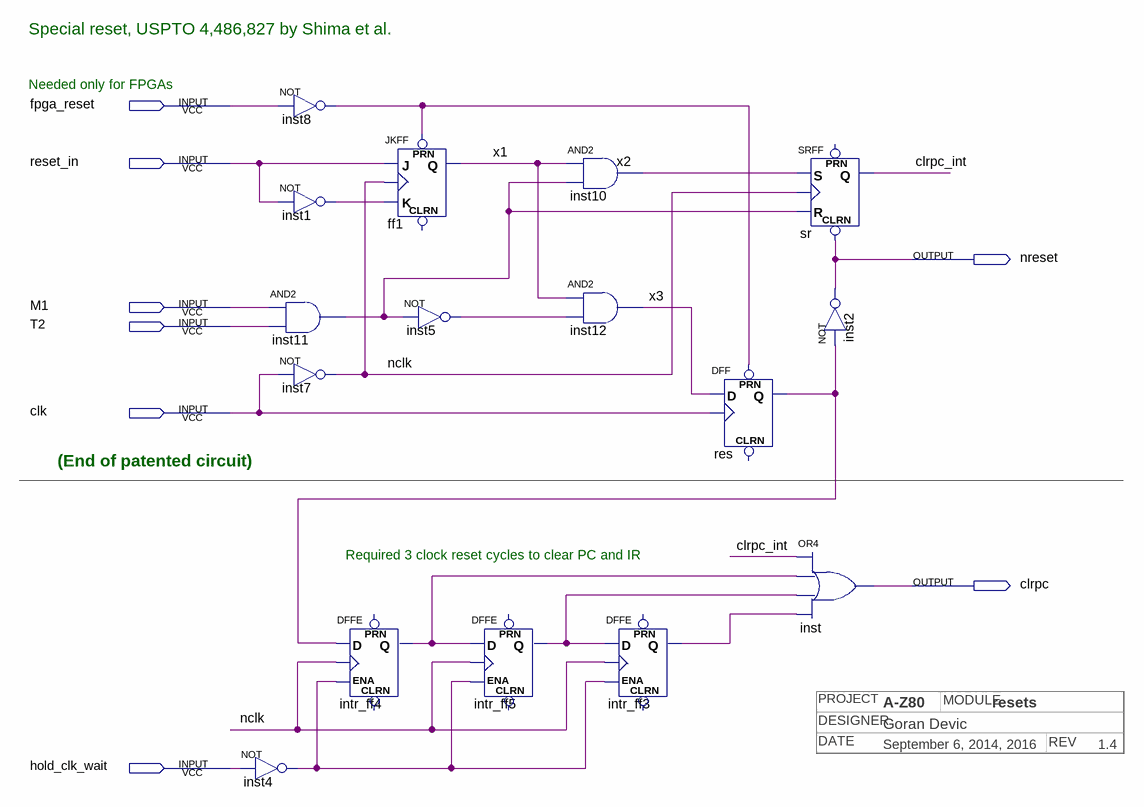
[diagram p0: schematic sheet]
// Quartus schematic resets.bdf as structural Verilog: 16 symbols, 8 pins
// Title block: DATE: September 6, 2014, 2016; DESIGNER: Goran Devic; MODULE: resets; PROJECT: A-Z80; REV: 1.4
module resets (
  input  fpga_reset,
  input  reset_in,
  input  M1,
  input  T2,
  input  clk,
  input  hold_clk_wait,
  output nreset,
  output clrpc
);

  wire clrpc_int, inst1_out, inst4_out, inst5_out, inst8_out, inst11_out, intr_ff3_q, intr_ff4_q, intr_ff5_q,
       nclk, res_q, x1, x2, x3;

  not inst8 (inst8_out, fpga_reset);
  not inst1 (inst1_out, reset_in);
  and inst11 (inst11_out, M1, T2);
  not inst7 (nclk, clk);
  not inst4 (inst4_out, hold_clk_wait);
  DFFE intr_ff4 (.D(res_q), .CLK(nclk), .ENA(inst4_out), .Q(intr_ff4_q));  // open: PRN, CLRN
  JKFF ff1 (.PRN(inst8_out), .K(inst1_out), .J(reset_in), .CLK(nclk), .Q(x1));  // open: CLRN
  not inst5 (inst5_out, inst11_out);
  DFFE intr_ff5 (.D(intr_ff4_q), .CLK(nclk), .ENA(inst4_out), .Q(intr_ff5_q));  // open: PRN, CLRN
  and inst10 (x2, x1, inst11_out);
  and inst12 (x3, x1, inst5_out);
  DFFE intr_ff3 (.D(intr_ff5_q), .CLK(nclk), .ENA(inst4_out), .Q(intr_ff3_q));  // open: PRN, CLRN
  DFF res (.CLK(clk), .D(x3), .PRN(inst8_out), .Q(res_q));  // open: CLRN
  SRFF sr (.CLRN(nreset), .S(x2), .R(inst11_out), .CLK(nclk), .Q(clrpc_int));  // open: PRN
  not inst2 (nreset, res_q);
  or inst (clrpc, clrpc_int, intr_ff4_q, intr_ff5_q, intr_ff3_q);

  // Notes on the sheet:
  //   Special reset, USPTO 4,486,827 by Shima et al.
  //   Needed only for FPGAs
  //   (End of patented circuit)
  //   Required 3 clock reset cycles to clear PC and IR
endmodule
